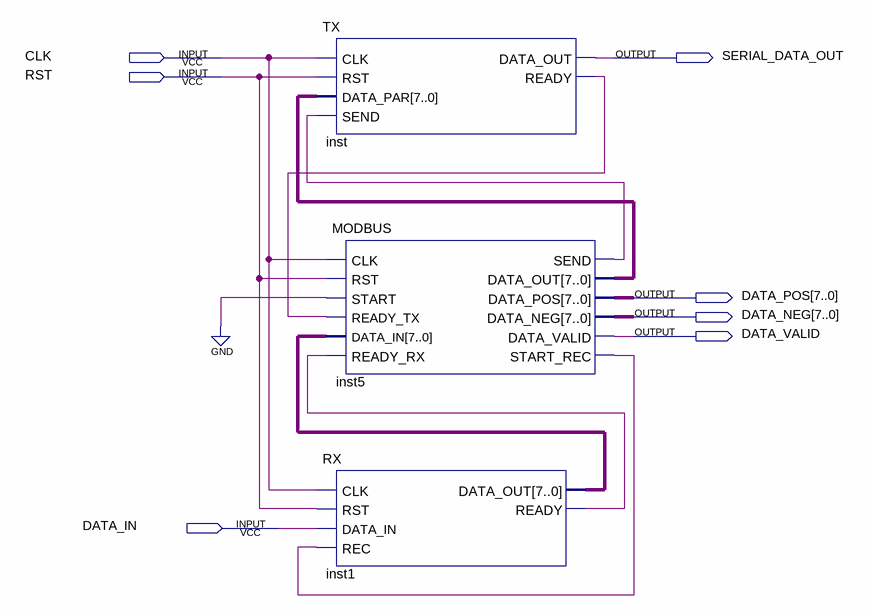
[diagram p0: schematic sheet]
// Quartus schematic uart_modbus.bdf as structural Verilog: 3 symbols, 7 pins
module uart_modbus (
  input  CLK,
  input  RST,
  input  DATA_IN,
  output SERIAL_DATA_OUT,
  output [7:0] DATA_POS,
  output [7:0] DATA_NEG,
  output DATA_VALID
);

  wire inst1_ready, inst5_send, inst5_start_rec, inst_ready;
  wire [7:0] inst1_data_out, inst5_data_out;

  TX inst (
    .CLK(CLK), .RST(RST), .DATA_PAR(inst5_data_out), .SEND(inst5_send), .DATA_OUT(SERIAL_DATA_OUT),
    .READY(inst_ready));
  MODBUS inst5 (
    .CLK(CLK), .RST(RST), .START(1'b0), .READY_TX(inst_ready), .DATA_IN(inst1_data_out),
    .READY_RX(inst1_ready), .SEND(inst5_send), .DATA_OUT(inst5_data_out), .START_REC(inst5_start_rec),
    .DATA_POS(DATA_POS), .DATA_NEG(DATA_NEG), .DATA_VALID(DATA_VALID));
  RX inst1 (
    .CLK(CLK), .RST(RST), .DATA_IN(DATA_IN), .REC(inst5_start_rec), .DATA_OUT(inst1_data_out),
    .READY(inst1_ready));
endmodule
